# EAGLE schematic Lamp Logic Board_10 (EAGLE 9.5.0)

## Sheet 1 of 4
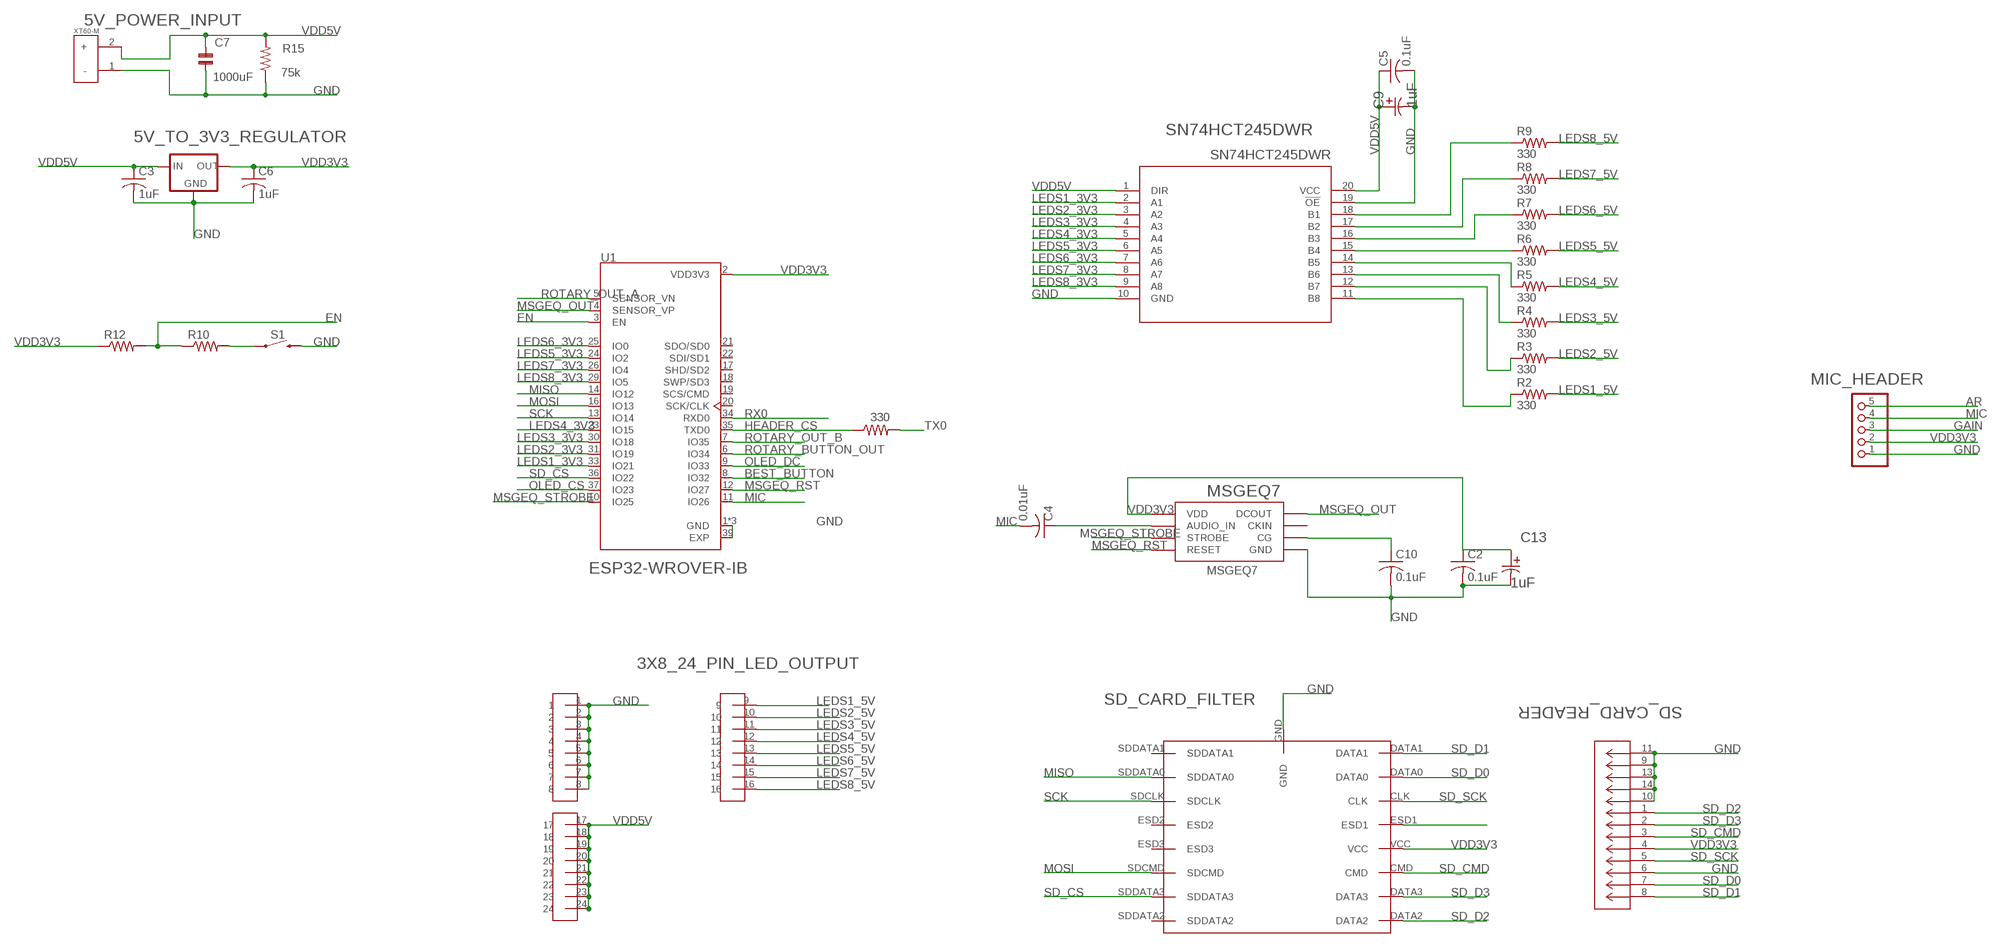
[diagram p0: schematic, sheet 1]

### Parts
3X8_24_PIN_LED_OUTPUT  3X8PINHEAD  [3X8PINHEAD]
5V_POWER_INPUT  XT60-M  [AMASS_XT60-M]
5V_TO_3V3_REGULATOR  LM1117MP-1.8  [SOT223]
C2  0.1uF  C-USC0805  [C0805]
C3  1uF  C-USC0402  [C0402]
C4  0.01uF  C-USC0402  [C0402]
C5  0.1uF  C-USC0805  [C0805]
C6  1uF  C-USC0402  [C0402]
C7  1000uF  C-BP-2,0X5  [ENP2,0-5]
C9  1uF  EEEFC1V1R0R  [CAP_EEFC_B]
C10  0.1uF  C-USC0805  [C0805]
C13  1uF  EEEFC1V1R0R  [CAP_EEFC_B]
MIC_HEADER  PINHD-1X5  [1X05]
MSGEQ7  MSGEQ7DIL  [DIL-08]
R1  330  R-US_R1206  [R1206]
R2  330  R-US_R1206  [R1206]
R3  330  R-US_R1206  [R1206]
R4  330  R-US_R1206  [R1206]
R5  330  R-US_R1206  [R1206]
R6  330  R-US_R1206  [R1206]
R7  330  R-US_R1206  [R1206]
R8  330  R-US_R1206  [R1206]
R9  330  R-US_R1206  [R1206]
R10  330  R-US_R1206  [R1206]
R12  12k  R-US_R0603  [R0603]
R15  75k  R-US_0309/12  [0309/12]
S1  MOMENTARY-SWITCH-SPST-SMD-6.0X3.5MM  [TACTILE_SWITCH_SMD_6.0X3.5MM]
SD_CARD_FILTER  CM1624-08DE  [CM1624-08DE]
SD_CARD_READER  LLC  [CON00218_8]
SN74HCT245DWR  SN74HCT245DWR  [DW20]
U1  ESP32-WROVER-IB  ESP32-WROVER-I  [XCVR_ESP32-WROVER-I]

### Nets
AR: MIC_HEADER.5
BEST_BUTTON: U1.8(IO32)
EN: R10.1 R12.2 U1.3(EN)
GAIN: MIC_HEADER.3
GND: 3X8_24_PIN_LED_OUTPUT.1 3X8_24_PIN_LED_OUTPUT.2 3X8_24_PIN_LED_OUTPUT.3 3X8_24_PIN_LED_OUTPUT.4 3X8_24_PIN_LED_OUTPUT.5 3X8_24_PIN_LED_OUTPUT.6 3X8_24_PIN_LED_OUTPUT.7 3X8_24_PIN_LED_OUTPUT.8 5V_POWER_INPUT.1(-) 5V_TO_3V3_REGULATOR.1(GND) C2.2 C3.2 C5.2 C6.2 C7.1 C9.2 C10.2 C13.2 MIC_HEADER.1 MSGEQ7.2(GND) R15.1 S1.2 SD_CARD_FILTER.GND SD_CARD_READER.6 SD_CARD_READER.9 SD_CARD_READER.10 SD_CARD_READER.11 SD_CARD_READER.13 SD_CARD_READER.14 SN74HCT245DWR.10(GND) SN74HCT245DWR.19(!OE) U1.1(GND) U1.15(GND) U1.38(GND) U1.39(EXP)
HEADER_CS: R1.1 U1.35(TXD0)
LEDS1_3V3: SN74HCT245DWR.2(A1) U1.33(IO21)
LEDS1_5V: 3X8_24_PIN_LED_OUTPUT.9 R2.2
LEDS2_3V3: SN74HCT245DWR.3(A2) U1.31(IO19)
LEDS2_5V: 3X8_24_PIN_LED_OUTPUT.10 R3.2
LEDS3_3V3: SN74HCT245DWR.4(A3) U1.30(IO18)
LEDS3_5V: 3X8_24_PIN_LED_OUTPUT.11 R4.2
LEDS4_3V3: SN74HCT245DWR.5(A4) U1.23(IO15)
LEDS4_5V: 3X8_24_PIN_LED_OUTPUT.12 R5.2
LEDS5_3V3: SN74HCT245DWR.6(A5) U1.24(IO2)
LEDS5_5V: 3X8_24_PIN_LED_OUTPUT.13 R6.2
LEDS6_3V3: SN74HCT245DWR.7(A6) U1.25(IO0)
LEDS6_5V: 3X8_24_PIN_LED_OUTPUT.14 R7.2
LEDS7_3V3: SN74HCT245DWR.8(A7) U1.26(IO4)
LEDS7_5V: 3X8_24_PIN_LED_OUTPUT.15 R8.2
LEDS8_3V3: SN74HCT245DWR.9(A8) U1.29(IO5)
LEDS8_5V: 3X8_24_PIN_LED_OUTPUT.16 R9.2
MIC: C4.2 MIC_HEADER.4 U1.11(IO26)
MISO: SD_CARD_FILTER.SDDATA0 U1.14(IO12)
MOSI: SD_CARD_FILTER.SDCMD U1.16(IO13)
MSGEQ_OUT: MSGEQ7.3(DCOUT) U1.4(SENSOR_VP)
MSGEQ_RST: MSGEQ7.7(RESET) U1.12(IO27)
MSGEQ_STROBE: MSGEQ7.4(STROBE) U1.10(IO25)
N$1: R9.1 SN74HCT245DWR.18(B1)
N$3: C4.1 MSGEQ7.5(AUDIO_IN)
N$4: C10.1 MSGEQ7.6(CG)
N$6: R8.1 SN74HCT245DWR.17(B2)
N$8: SD_CARD_FILTER.ESD1
N$9: R10.2 S1.1
N$10: R7.1 SN74HCT245DWR.16(B3)
N$11: R6.1 SN74HCT245DWR.15(B4)
N$12: R5.1 SN74HCT245DWR.14(B5)
N$13: R4.1 SN74HCT245DWR.13(B6)
N$14: R3.1 SN74HCT245DWR.12(B7)
N$15: R2.1 SN74HCT245DWR.11(B8)
OLED_CS: U1.37(IO23)
OLED_DC: U1.9(IO33)
ROTARY_BUTTON_OUT: U1.6(IO34)
ROTARY_OUT_A: U1.5(SENSOR_VN)
ROTARY_OUT_B: U1.7(IO35)
RX0: U1.34(RXD0)
SCK: SD_CARD_FILTER.SDCLK U1.13(IO14)
SD_CMD: SD_CARD_FILTER.CMD SD_CARD_READER.3
SD_CS: SD_CARD_FILTER.SDDATA3 U1.36(IO22)
SD_D0: SD_CARD_FILTER.DATA0 SD_CARD_READER.7
SD_D1: SD_CARD_FILTER.DATA1 SD_CARD_READER.8
SD_D2: SD_CARD_FILTER.DATA2 SD_CARD_READER.1
SD_D3: SD_CARD_FILTER.DATA3 SD_CARD_READER.2
SD_SCK: SD_CARD_FILTER.CLK SD_CARD_READER.5
TX0: R1.2
VDD3V3: 5V_TO_3V3_REGULATOR.2(OUT) 5V_TO_3V3_REGULATOR.4(OUT) C2.1 C6.1 C13.1 MIC_HEADER.2 MSGEQ7.1(VDD) R12.1 SD_CARD_FILTER.VCC SD_CARD_READER.4 U1.2(VDD3V3)
VDD5V: 3X8_24_PIN_LED_OUTPUT.17 3X8_24_PIN_LED_OUTPUT.18 3X8_24_PIN_LED_OUTPUT.19 3X8_24_PIN_LED_OUTPUT.20 3X8_24_PIN_LED_OUTPUT.21 3X8_24_PIN_LED_OUTPUT.22 3X8_24_PIN_LED_OUTPUT.23 3X8_24_PIN_LED_OUTPUT.24 5V_POWER_INPUT.2(+) 5V_TO_3V3_REGULATOR.3(IN) C3.1 C5.1 C7.2 C9.1 R15.2 SN74HCT245DWR.1(DIR) SN74HCT245DWR.20(VCC)
Unconnected: MSGEQ7.8(CKIN) SD_CARD_FILTER.ESD2 SD_CARD_FILTER.ESD3 SD_CARD_FILTER.SDDATA1 SD_CARD_FILTER.SDDATA2 U1.17(SHD/SD2) U1.18(SWP/SD3) U1.19(SCS/CMD) U1.20(SCK/CLK) U1.21(SDO/SD0) U1.22(SDI/SD1)

## Sheet 2 of 4

## Sheet 3 of 4

## Sheet 4 of 4

## Library data of the parts
3X8_24_PIN_LED_OUTPUT = 3X8PINHEAD:3X8PINHEAD
5V_POWER_INPUT = XT60-M:XT60-M: DC supply; XT60; male; PIN:2; for cable; soldered; 60A; 500V; AVAILABILITY: Unavailable; MF: AMASS; MP: XT60-M; PACKAGE: Package Analog Devices; PRICE: None
5V_TO_3V3_REGULATOR = lm1117:LM1117?-*: 800mA Low-Dropout Linear Regulator Source: http://ww1.microchip.com/downloads/en/DeviceDoc/39760d.pdf; MF: Texas Instruments; MPN: LM1117MP-1.8; OC_FARNELL: 1469053; OC_NEWARK: 41K3467
C2-C6 C10 = resistor:C-US: CAPACITOR, American symbol
C7 = cap-pan40:C-BP: BIPOLAR ELECTROLYTIC
C9 C13 = EEE-FC1V1R0R:EEEFC1V1R0R; MANUFACTURER_PART_NUMBER: EEEFC1V1R0R; VENDOR: Panasonic
MIC_HEADER = pinhead:PINHD-1X5: PIN HEADER
MSGEQ7 = MSGEQ7:MSGEQ7: 7-band graphic equalizer; DESCRIPTION: Seven Band Graphic Equalizer Display Filter; DIGI-KEY_PART_NUMBER: 1568-1544-ND; DIGI-KEY_PURCHASE_URL: https://www.digikey.com/product-detail/en/sparkfun-electronics/DEV-13116/1568-1544-ND/5764478?utm_source=snapeda&utm_medium=aggregator&utm_campaign=symbol; MF: SparkFun Electronics; MP: MSGEQ7; PACKAGE: SOIC-8 Mixed Signal Integration
R1-R10 R12 R15 = resistor:R-US_: RESISTOR, American symbol
S1 = SparkFun-Switches:MOMENTARY-SWITCH-SPST: Momentary Switch (Pushbutton) - SPST Normally-open (NO) SPST momentary switches (buttons, pushbuttons). Variants PTH-12MM - 12mm square, through-hole Momentary Pushbutton Switch - 12mm Square <https://www.sparkfun.com/products/9190> (COM-09190) PTH-6.0MM, PTH-6.0MM-KIT - 6.0mm square, through-hole Mini Pushbutton Switch <https://www.sparkfun.com/products/97> (COM-00097) KIT package intended for soldering kit's - only one side of pads' copper is exposed. PTH-RIGHT-ANGLE-KIT - Right-angle, through-hole Right Angle Tactile Button <https://www.sparkfun.com/products/10791> - Used on SparkFun BigTime Watch Kit <https://www.sparkfun.com/products/11734> SMD-12MM - 12mm square, surface-mount Tactile Button - SMD (12mm) <https://www.sparkfun.com/products/12993> (COM-12993) Used on SparkFun PicoBoard <https://www.sparkfun.com/products/11888> SMD-4.5MM - 4.5mm Square Trackball Switch Used on SparkFun Blackberry Trackballer Breakout <https://www.sparkfun.com/products/13169> SMD-4.6MMX2.8MM - 4.60mm x 2.80mm, surface mount Used on SparkFun SAMD21 Mini Breakout <https://www.sparkfun.com/products/13664> SMD-5.2MM, SMD-5.2-REDUNDANT - 5.2mm square, surface-mount Mini Pushbutton Switch - SMD <https://www.sparkfun.com/products/8720> (COM-08720) Used on Arduino Pro Mini <https://www.sparkfun.com/products/11114> REDUNDANT package connects both switch circuits together SMD-6.0X3.5MM - 6.0 x 3.5mm, surface mount Momentary Reset Switch SMD <https://www.sparkfun.com/products/8229> (COM-08229) SMD-6.2MM-TALL - 6.2mm square, surface mount Tactile Button - SMD (6mm) <https://www.sparkfun.com/products/12992> Used on SparkFun Digital Sandbox <https://www.sparkfun.com/products/12651> SMD-RIGHT-ANGLE - Right-angle, surface mount Used on SparkFun Block for Intel® Edison - Arduino <https://www.sparkfun.com/products/13036>; PROD_ID: SWCH-00815; SF_SKU: COM-08229
SD_CARD_FILTER = CM1624-08DE:CM1624-08DE
SD_CARD_READER = 5027740891:LLC; MANUFACTURER_PART_NUMBER: LLC; VENDOR: Molex Connector Corporation
SN74HCT245DWR = SN74HCT245DWR :SN74HCT245DWR; MANUFACTURER_PART_NUMBER: SN74HCT245DWR; VENDOR: Texas Instruments
U1 = ESP32-WROVER-I:ESP32-WROVER-I: Module: combo; GPIO, I2C x2, I2S x2, SDIO, SPI x3, UART x3; U.FL; AVAILABILITY: Unavailable; DESCRIPTION: Module: combo; GPIO, I2C x2, I2S x2, SDIO, SPI x3, UART x3; U.FL; MF: Espressif Systems; MP: ESP32-WROVER-I; PACKAGE: Module Espressif Systems; PRICE: None